# Altium schematic sheet AltiumScheme.schdoc
size 105 x 84 mm
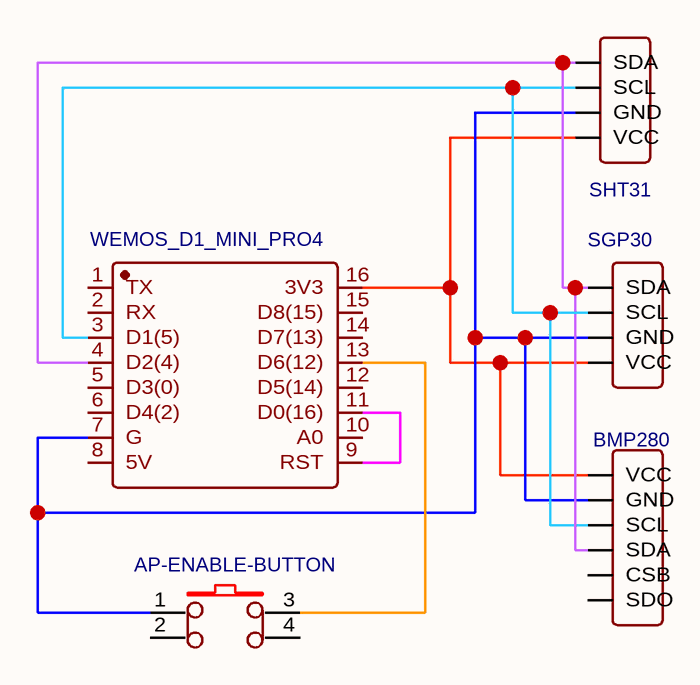
[diagram p0: AltiumScheme.schdoc]

## Parts
AP-ENABLE-BUTTON  button6*6*8.5  [KEY-TH_4P-L6.0-W6.0-P4.50]  (value not drawn)
BMP280  HDR-F-2.54_1x6  [HDR-F-2.54_1X6]  (value not drawn)
SGP30  HDR-F-2.54_1x4  [HDR-F-2.54_1X4]  (value not drawn)
SHT31  HDR-F-2.54_1x4  [HDR-F-2.54_1X4]  (value not drawn)
U1  WEMOS_D1_MINI_PRO4  [DIP-16_WEMOS_D1_MINI_PRO4]

## Nets
NetAP-ENABLE-BUTTON_1: AP-ENABLE-BUTTON.1 BMP280.2(GND) SGP30.3(GND) SHT31.3(GND) U1.7(G)
NetAP-ENABLE-BUTTON_3: AP-ENABLE-BUTTON.3 U1.13(D6(12))
NetBMP280_1: BMP280.1(VCC) SGP30.4(VCC) SHT31.4(VCC) U1.16(3V3)
NetBMP280_3: BMP280.3(SCL) SGP30.2(SCL) SHT31.2(SCL) U1.3(D1(5))
NetBMP280_4: BMP280.4(SDA) SGP30.1(SDA) SHT31.1(SDA) U1.4(D2(4))
NetU1_9: U1.9(RST) U1.11(D0(16))

Not connected (* = marked no-connect by the designer): AP-ENABLE-BUTTON 2 4; BMP280 5(CSB) 6(SDO); U1 1(TX) 2(RX) 5(D3(0)) 6(D4(2)) 8(5V) 10(A0) 12(D5(14)) 14(D7(13)) 15(D8(15))

## Library data of the parts
AP-ENABLE-BUTTON = button6*6*8.5: BOM_Manufacturer: ReliaPro; BOM_Supplier Part: C59980; BOM_Supplier: LCSC; BOM_Manufacturer Part: button6*6*8.5; spicePre: K; spiceSymbolName: button6*6*8.5
BMP280 = HDR-F-2.54_1x6: Contributor: LCEDA_Lib; BOM_Supplier Part: C40877; BOM_Supplier: LCSC; spicePre: H; spiceSymbolName: HDR-F-2.54_1x6
SGP30 SHT31 = HDR-F-2.54_1x4: Contributor: LCEDA_Lib; BOM_Supplier Part: C225501; BOM_Supplier: LCSC; spicePre: H; spiceSymbolName: HDR-F-2.54_1x4
U1 = WEMOS_D1_MINI_PRO4: BOM_Manufacturer: null; Contributor: LCSC; BOM_Supplier: LCSC; BOM_Supplier Part: C2837266; BOM_Manufacturer Part: Wemos_D1_mini_Pro4; BOM_JLCPCB Part Class: Extended Part; spicePre: U; spiceSymbolName: WEMOS_D1_MINI_PRO4